# EAGLE schematic nanobone (EAGLE 6.3)
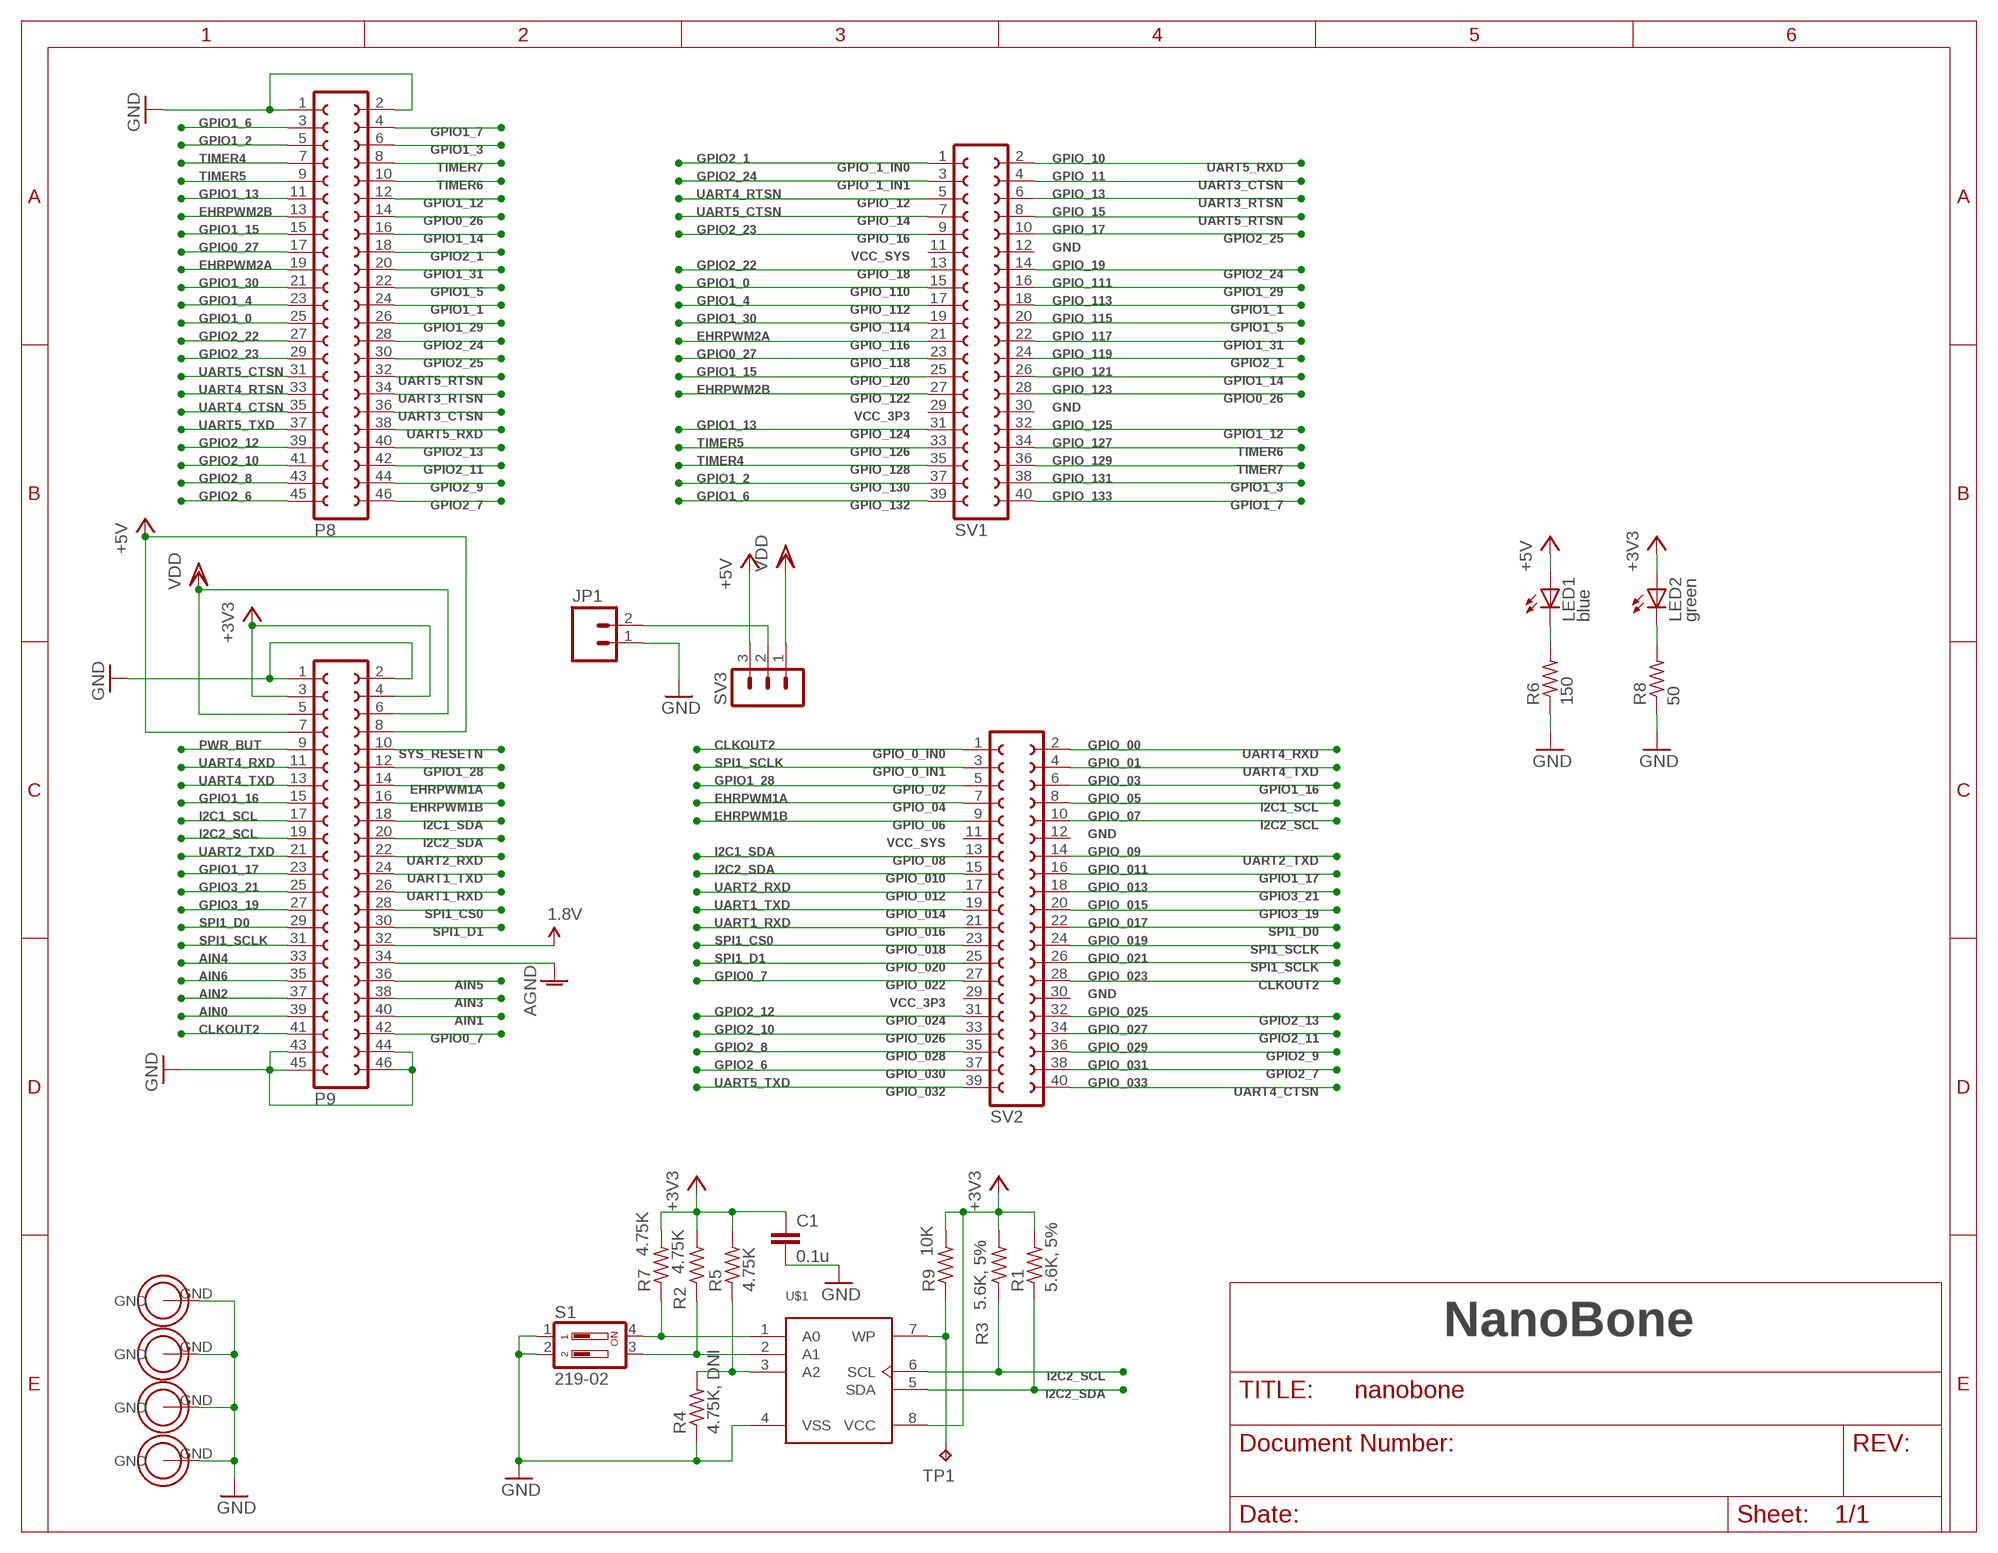
[diagram p0: schematic, sheet 1]

## Parts
C1  0.1u  C-EUC0603  [C0603]
H1  HOLE  [HOLE]
H2  HOLE  [HOLE]
H3  HOLE  [HOLE]
H4  HOLE  [HOLE]
JP1  M02LOCK_LONGPADS  [1X02_LOCK_LONGPADS]
LED1  blue  LEDCHIPLED_0603  [CHIPLED_0603]
LED2  green  LEDCHIPLED_0603  [CHIPLED_0603]
P8  FE23-2_SMD  [FE23-2_SMD]
P9  FE23-2_SMD  [FE23-2_SMD]
R1  5.6K, 5%  R-US_R0603  [R0603]
R2  4.75K  R-US_R0603  [R0603]
R3  5.6K, 5%  R-US_R0603  [R0603]
R4  4.75K, DNI  R-US_R0603  [R0603]
R5  4.75K  R-US_R0603  [R0603]
R6  150  R-US_R0603  [R0603]
R7  4.75K  R-US_R0603  [R0603]
R8  50  R-US_R0603  [R0603]
R9  10K  R-US_R0603  [R0603]
S1  219-02  [CTS-219-02]
SV1  FE20-2  [FE20-2]
SV2  FE20-2  [FE20-2]
SV3  MA03-1  [MA03-1]
TP1  TPB2,54  [B2,54]
U$1  CAT24C256  [SOIC8]

## Nets
1.8V: P9.32
+3V3 [pwr]: C1.1 LED2.A P9.3 P9.4 R1.2 R2.2 R3.2 R5.2 R7.2 R9.2 U$1.8(VCC)
+5V [pwr]: LED1.A P9.7 P9.8 SV3.3
AGND: P9.34
AIN0: P9.39
AIN1: P9.40
AIN2: P9.37
AIN3: P9.38
AIN4: P9.33
AIN5: P9.36
AIN6: P9.35
CLKOUT2: P9.41 SV2.1 SV2.28
EHRPWM1A: P9.14 SV2.7
EHRPWM1B: P9.16 SV2.9
EHRPWM2A: P8.19 SV1.21
EHRPWM2B: P8.13 SV1.27
GND [pwr]: C1.2 H1.GND H2.GND H3.GND H4.GND JP1.1 P8.1 P8.2 P9.1 P9.2 P9.43 P9.44 P9.45 P9.46 R4.1 R6.1 R8.1 S1.1 S1.2 U$1.4(VSS)
GPIO0_7: P9.42 SV2.27
GPIO0_26: P8.14 SV1.28
GPIO0_27: P8.17 SV1.23
GPIO1_0: P8.25 SV1.15
GPIO1_1: P8.24 SV1.18
GPIO1_2: P8.5 SV1.37
GPIO1_3: P8.6 SV1.38
GPIO1_4: P8.23 SV1.17
GPIO1_5: P8.22 SV1.20
GPIO1_6: P8.3 SV1.39
GPIO1_7: P8.4 SV1.40
GPIO1_12: P8.12 SV1.32
GPIO1_13: P8.11 SV1.31
GPIO1_14: P8.16 SV1.26
GPIO1_15: P8.15 SV1.25
GPIO1_16: P9.15 SV2.6
GPIO1_17: P9.23 SV2.16
GPIO1_28: P9.12 SV2.5
GPIO1_29: P8.26 SV1.16
GPIO1_30: P8.21 SV1.19
GPIO1_31: P8.20 SV1.22
GPIO2_1: P8.18 SV1.1 SV1.24
GPIO2_6: P8.45 SV2.37
GPIO2_7: P8.46 SV2.38
GPIO2_8: P8.43 SV2.35
GPIO2_9: P8.44 SV2.36
GPIO2_10: P8.41 SV2.33
GPIO2_11: P8.42 SV2.34
GPIO2_12: P8.39 SV2.31
GPIO2_13: P8.40 SV2.32
GPIO2_22: P8.27 SV1.13
GPIO2_23: P8.29 SV1.9
GPIO2_24: P8.28 SV1.3 SV1.14
GPIO2_25: P8.30 SV1.10
GPIO3_19: P9.27 SV2.20
GPIO3_21: P9.25 SV2.18
I2C1_SCL: P9.17 SV2.8
I2C1_SDA: P9.18 SV2.13
I2C2_SCL: P9.19 R3.1 SV2.10 U$1.6(SCL)
I2C2_SDA: P9.20 R1.1 SV2.15 U$1.5(SDA)
N$1: R7.1 S1.4 U$1.1(A0)
N$2: R2.1 S1.3 U$1.2(A1)
N$3: R4.2 R5.1 U$1.3(A2)
N$4: JP1.2 SV3.2
N$5: R9.1 TP1.TP U$1.7(WP)
N$6: LED1.C R6.2
N$7: LED2.C R8.2
PWR_BUT: P9.9
SPI1_CS0: P9.28 SV2.23
SPI1_D0: P9.29 SV2.22
SPI1_D1: P9.30 SV2.25
SPI1_SCLK: P9.31 SV2.3 SV2.24 SV2.26
SYS_RESETN: P9.10
TIMER4: P8.7 SV1.35
TIMER5: P8.9 SV1.33
TIMER6: P8.10 SV1.34
TIMER7: P8.8 SV1.36
UART1_RXD: P9.26 SV2.21
UART1_TXD: P9.24 SV2.19
UART2_RXD: P9.22 SV2.17
UART2_TXD: P9.21 SV2.14
UART3_CTSN: P8.36 SV1.4
UART3_RTSN: P8.34 SV1.6
UART4_CTSN: P8.35 SV2.40
UART4_RTSN: P8.33 SV1.5
UART4_RXD: P9.11 SV2.2
UART4_TXD: P9.13 SV2.4
UART5_CTSN: P8.31 SV1.7
UART5_RTSN: P8.32 SV1.8
UART5_RXD: P8.38 SV1.2
UART5_TXD: P8.37 SV2.39
VDD [pwr]: P9.5 P9.6 SV3.1
Unconnected: SV1.11 SV1.12 SV1.29 SV1.30 SV2.11 SV2.12 SV2.29 SV2.30

## Notes on the sheet
- GPIO_1_IN0 | GPIO_10
- GPIO_1_IN1 | GPIO_11
- GPIO_12 | GPIO_13
- GPIO_14 | GPIO_15
- GPIO_16 | GPIO_17
- VCC_SYS | GND
- GPIO_18 | GPIO_19
- GPIO_110 | GPIO_111
- GPIO_112 | GPIO_113
- GPIO_114 | GPIO_115
- GPIO_116 | GPIO_117
- GPIO_118 | GPIO_119
- GPIO_120 | GPIO_121
- GPIO_122 | GPIO_123
- VCC_3P3 | GND
- GPIO_124 | GPIO_125
- GPIO_126 | GPIO_127
- GPIO_128 | GPIO_129
- GPIO_130 | GPIO_131
- GPIO_132 | GPIO_133
- GPIO_0_IN0 | GPIO_00
- GPIO_0_IN1 | GPIO_01
- GPIO_02 | GPIO_03
- GPIO_04 | GPIO_05
- GPIO_06 | GPIO_07
- VCC_SYS | GND
- GPIO_08 | GPIO_09
- GPIO_010 | GPIO_011
- GPIO_012 | GPIO_013
- GPIO_014 | GPIO_015
- GPIO_016 | GPIO_017
- GPIO_018 | GPIO_019
- GPIO_020 | GPIO_021
- GPIO_022 | GPIO_023
- VCC_3P3 | GND
- GPIO_024 | GPIO_025
- GPIO_026 | GPIO_027
- GPIO_028 | GPIO_029
- GPIO_030 | GPIO_031
- GPIO_032 | GPIO_033
- NanoBone

## Library data of the parts
C1 = rcl:C-EU: CAPACITOR, European symbol; MPN: VJ0603V104ZXXCW1BC
H1-H4 = BoneCapeParts:HOLE
JP1 = SparkFun-Connectors:M02: Header 2 Standard 2-pin 0.1" header. Use with straight break away headers (SKU : PRT-00116), right angle break away headers (PRT-00553), swiss pins (PRT-00743), machine pins (PRT-00117), and female headers (PRT-00115). Molex polarized connector foot print use with SKU : PRT-08233 with associated crimp pins and housings.
LED1 = led:LED: LED OSRAM: - CHIPLED LG R971, LG N971, LY N971, LG Q971, LY Q971, LO R971, LY R971 LH N974, LH R974 LS Q976, LO Q976, LY Q976 LO Q996 - Hyper CHIPLED LW Q18S LB Q993, LB Q99A, LB R99A - SideLED LS A670, LO A670, LY A670, LG A670, LP A670 LB A673, LV A673, LT A673, LW A673 LH A674 LY A675 LS A676, LA A676, LO A676, LY A676, LW A676 LS A679, LY A679, LG A679 - Hyper Micro SIDELED® LS Y876, LA Y876, LO Y876, LY Y876 LT Y87S - SmartLED LW L88C, LW L88S LB L89C, LB L89S, LG L890 LS L89K, LO L89K, LY L89K LS L896, LA L896, LO L896, LY L896 - TOPLED LS T670, LO T670, LY T670, LG T670, LP T670 LSG T670, LSP T670, LSY T670, LOP T670, LYG T670 LG T671, LOG T671, LSG T671 LB T673, LV T673, LT T673, LW T673 LH T674 LS T676, LA T676, LO T676, LY T676, LB T676, LH T676, LSB T676, LW T676 LB T67C, LV T67C, LT T67C, LS T67K, LO T67K, LY T67K, LW E67C LS E67B, LA E67B, LO E67B, LY E67B, LB E67C, LV E67C, LT E67C LW T67C LS T679, LY T679, LG T679 LS T770, LO T770, LY T770, LG T770, LP T770 LB T773, LV T773, LT T773, LW T773 LH T774 LS E675, LA E675, LY E675, LS T675 LS T776, LA T776, LO T776, LY T776, LB T776 LHGB T686 LT T68C, LB T68C - Hyper Mini TOPLED® LB M676 - Mini TOPLED Santana® LG M470 LS M47K, LO M47K, LY M47K Source: http://www.osram.convergy.de LUXEON: - LUMILED® LXK2-PW12-R00, LXK2-PW12-S00, LXK2-PW14-U00, LXK2-PW14-V00 LXK2-PM12-R00, LXK2-PM12-S00, LXK2-PM14-U00 LXK2-PE12-Q00, LXK2-PE12-R00, LXK2-PE12-S00, LXK2-PE14-T00, LXK2-PE14-U00 LXK2-PB12-K00, LXK2-PB12-L00, LXK2-PB12-M00, LXK2-PB14-N00, LXK2-PB14-P00, LXK2-PB14-Q00 LXK2-PR12-L00, LXK2-PR12-M00, LXK2-PR14-Q00, LXK2-PR14-R00 LXK2-PD12-Q00, LXK2-PD12-R00, LXK2-PD12-S00 LXK2-PH12-R00, LXK2-PH12-S00 LXK2-PL12-P00, LXK2-PL12-Q00, LXK2-PL12-R00 Source: www.luxeon.com KINGBRIGHT: KA-3528ASYC Source: www.kingbright.com; MPN: HT-193NB-5589
LED2 = led:LED: LED OSRAM: - CHIPLED LG R971, LG N971, LY N971, LG Q971, LY Q971, LO R971, LY R971 LH N974, LH R974 LS Q976, LO Q976, LY Q976 LO Q996 - Hyper CHIPLED LW Q18S LB Q993, LB Q99A, LB R99A - SideLED LS A670, LO A670, LY A670, LG A670, LP A670 LB A673, LV A673, LT A673, LW A673 LH A674 LY A675 LS A676, LA A676, LO A676, LY A676, LW A676 LS A679, LY A679, LG A679 - Hyper Micro SIDELED® LS Y876, LA Y876, LO Y876, LY Y876 LT Y87S - SmartLED LW L88C, LW L88S LB L89C, LB L89S, LG L890 LS L89K, LO L89K, LY L89K LS L896, LA L896, LO L896, LY L896 - TOPLED LS T670, LO T670, LY T670, LG T670, LP T670 LSG T670, LSP T670, LSY T670, LOP T670, LYG T670 LG T671, LOG T671, LSG T671 LB T673, LV T673, LT T673, LW T673 LH T674 LS T676, LA T676, LO T676, LY T676, LB T676, LH T676, LSB T676, LW T676 LB T67C, LV T67C, LT T67C, LS T67K, LO T67K, LY T67K, LW E67C LS E67B, LA E67B, LO E67B, LY E67B, LB E67C, LV E67C, LT E67C LW T67C LS T679, LY T679, LG T679 LS T770, LO T770, LY T770, LG T770, LP T770 LB T773, LV T773, LT T773, LW T773 LH T774 LS E675, LA E675, LY E675, LS T675 LS T776, LA T776, LO T776, LY T776, LB T776 LHGB T686 LT T68C, LB T68C - Hyper Mini TOPLED® LB M676 - Mini TOPLED Santana® LG M470 LS M47K, LO M47K, LY M47K Source: http://www.osram.convergy.de LUXEON: - LUMILED® LXK2-PW12-R00, LXK2-PW12-S00, LXK2-PW14-U00, LXK2-PW14-V00 LXK2-PM12-R00, LXK2-PM12-S00, LXK2-PM14-U00 LXK2-PE12-Q00, LXK2-PE12-R00, LXK2-PE12-S00, LXK2-PE14-T00, LXK2-PE14-U00 LXK2-PB12-K00, LXK2-PB12-L00, LXK2-PB12-M00, LXK2-PB14-N00, LXK2-PB14-P00, LXK2-PB14-Q00 LXK2-PR12-L00, LXK2-PR12-M00, LXK2-PR14-Q00, LXK2-PR14-R00 LXK2-PD12-Q00, LXK2-PD12-R00, LXK2-PD12-S00 LXK2-PH12-R00, LXK2-PH12-S00 LXK2-PL12-P00, LXK2-PL12-Q00, LXK2-PL12-R00 Source: www.luxeon.com KINGBRIGHT: KA-3528ASYC Source: www.kingbright.com; MPN: LG Q971-KN-1
P8 P9 = BoneCapeParts:FE23-2_SMD: FEMALE HEADER; MPN: NPPC232KFMS-RC; OC_FARNELL: unknown; OC_NEWARK: unknown
R1 R3 = rcl:R-US_: RESISTOR, American symbol; MPN: RK73B1JTTDD562J
R2 R4 R5 R7 = rcl:R-US_: RESISTOR, American symbol; MPN: CR0603-FX-4751GLF
R6 = rcl:R-US_: RESISTOR, American symbol; MPN: 302-150-RC
R8 = rcl:R-US_: RESISTOR, American symbol; MPN: 302-49.9-RC
R9 = rcl:R-US_: RESISTOR, American symbol; MPN: WR06X1002FTL
S1 = switch-dil:219-02*: Surface Mount DIP Switch Series 219 SMT CTS Electronic Components Sourc: www.ctscorp.com; MPN: 219-2MST; OC_FARNELL: unknown; OC_NEWARK: unknown
SV1 SV2 = BoneCapeParts:FE20-2: FEMALE HEADER; MPN: NPPC202KFMS-RC; OC_FARNELL: unknown; OC_NEWARK: unknown
SV3 = con-lstb:MA03-1: PIN HEADER; OC_FARNELL: unknown; OC_NEWARK: unknown
TP1 = testpad:TP: Test pad
U$1 = BoneCapeParts:CAT24C256; MPN: CAT24C256WI-GT3

## Net classes
0 default: width 0.203 mm, drill 0.381 mm, clearance 0.203 mm
1 pwr: width 0.61 mm, drill 0.508 mm, clearance 0.203 mm